# Altium project IR emitter.PrjPcb
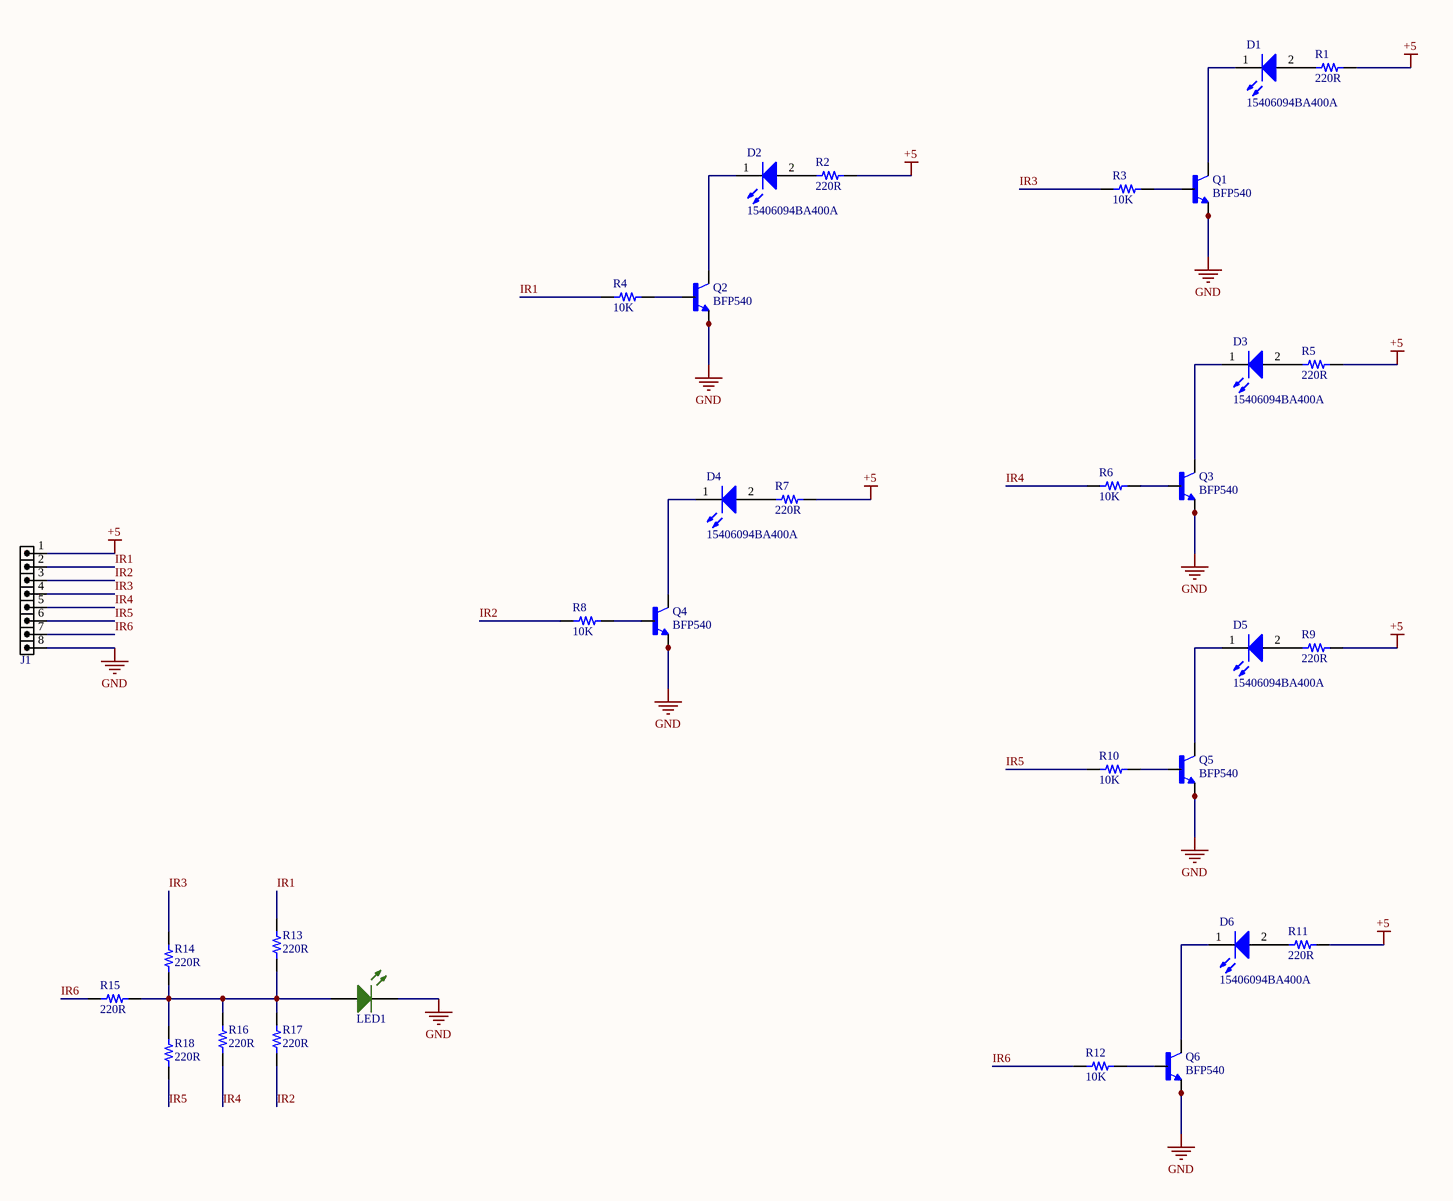
[diagram p0: IR emitter.SchDoc]
2 sheets, 64 parts. Net scope: global (net labels, ports and power ports of the same name join across sheets).
Board file: IR emitter.PcbDoc
Sheets:
  IR emitter.SchDoc
  Sheet1.SchDoc

## Sheet IR emitter.SchDoc
size A3; SheetNumber: 1; SheetTotal: 1

### Parts
D1  15406094BA400A  [WL-SICW_0603_L1.6W0.8H0.88]
D2  15406094BA400A  [WL-SICW_0603_L1.6W0.8H0.88]
D3  15406094BA400A  [WL-SICW_0603_L1.6W0.8H0.88]
D4  15406094BA400A  [WL-SICW_0603_L1.6W0.8H0.88]
D5  15406094BA400A  [WL-SICW_0603_L1.6W0.8H0.88]
D6  15406094BA400A  [WL-SICW_0603_L1.6W0.8H0.88]
J1  HDR1X8  [HDRR_M_1X8]  (value not drawn)
LED1  LED SMD 0603 GREEN  [LED_0603_GREEN]  (value not drawn)
Q1  BFP540  [TRANS_BFP540]
Q2  BFP540  [TRANS_BFP540]
Q3  BFP540  [TRANS_BFP540]
Q4  BFP540  [TRANS_BFP540]
Q5  BFP540  [TRANS_BFP540]
Q6  BFP540  [TRANS_BFP540]
R1  220R  [RES 0603_1608]
R2  220R  [RES 0603_1608]
R3  10K  [RES 0603_1608]
R4  10K  [RES 0603_1608]
R5  220R  [RES 0603_1608]
R6  10K  [RES 0603_1608]
R7  220R  [RES 0603_1608]
R8  10K  [RES 0603_1608]
R9  220R  [RES 0603_1608]
R10  10K  [RES 0603_1608]
R11  220R  [RES 0603_1608]
R12  10K  [RES 0603_1608]
R13  220R  [RES 0603_1608]
R14  220R  [RES 0603_1608]
R15  220R  [RES 0603_1608]
R16  220R  [RES 0603_1608]
R17  220R  [RES 0603_1608]
R18  220R  [RES 0603_1608]

### Nets
+5: J1.1 R1.1 R2.1 R5.1 R7.1 R9.1 R11.1
GND: J1.8 LED1.2(K) Q1.2(E) Q1.4(E) Q2.2(E) Q2.4(E) Q3.2(E) Q3.4(E) Q4.2(E) Q4.4(E) Q5.2(E) Q5.4(E) Q6.2(E) Q6.4(E)
IR1: J1.2 J1.7 R4.2 R12.2 R13.1 R15.2  [also labelled IR6]
IR2: J1.3 R8.2 R17.2
IR3: J1.4 R3.2 R14.1
IR4: J1.5 R6.2 R16.2
IR5: J1.6 R10.2 R18.2
NetD1_1: D1.1(K) Q1.3(C)
NetD1_2: D1.2(A) R1.2
NetD2_1: D2.1(K) Q2.3(C)
NetD2_2: D2.2(A) R2.2
NetD3_1: D3.1(K) Q3.3(C)
NetD3_2: D3.2(A) R5.2
NetD4_1: D4.1(K) Q4.3(C)
NetD4_2: D4.2(A) R7.2
NetD5_1: D5.1(K) Q5.3(C)
NetD5_2: D5.2(A) R9.2
NetD6_1: D6.1(K) Q6.3(C)
NetD6_2: D6.2(A) R11.2
NetLED1_1: LED1.1(A) R13.2 R14.2 R15.1 R16.1 R17.1 R18.1
NetQ1_1: Q1.1(B) R3.1
NetQ2_1: Q2.1(B) R4.1
NetQ3_1: Q3.1(B) R6.1
NetQ4_1: Q4.1(B) R8.1
NetQ5_1: Q5.1(B) R10.1
NetQ6_1: Q6.1(B) R12.1

### Library data of the parts
D1-D6 = CMP-03913-108242140-1: 15406094BA400A Ir Emitter, 940Nm, 0603 Rohs Compliant: Yes; Max Reverse Voltage (DC): 5V; Forward Current: 700mA; Forward Voltage: 1.2V; Viewing Angle: 140°; RoHS: Compliant; Peak Wavelength: 940nm; Width: 800µm; Min Operating Temperature: -40°C; NexarPartId: 108242140; Length: 1.6mm; Max Operating Temperature: 85°C; Height: 900µm
J1 = HDRR_M_1X8: CONN, HEADER, RightAngle, Male, pitch: 2.54mm, 8POS; VALUE: HDRM8
Q1-Q6 = BFP540: RF Transistor NPN 5V 80mA 30GHz 250mW Surface Mount PG-SOT343-4; MF: Infineon; Package: SOT-343 Infineon; Price: None; Check_prices: https://www.snapeda.com/parts/BFP540/Infineon/view-part/?ref=eda; Value: *; SnapEDA_Link: https://www.snapeda.com/parts/BFP540/Infineon/view-part/?ref=snap; MP: BFP540; Availability: In Stock; Purchase-URL: https://pricing.snapeda.com/search/part/BFP540/?ref=eda
R1-R18 = Res 0603: SMT Resistor; VALUE: 1K

## Sheet Sheet1.SchDoc
size A3; SheetNumber: 2; SheetTotal: 2
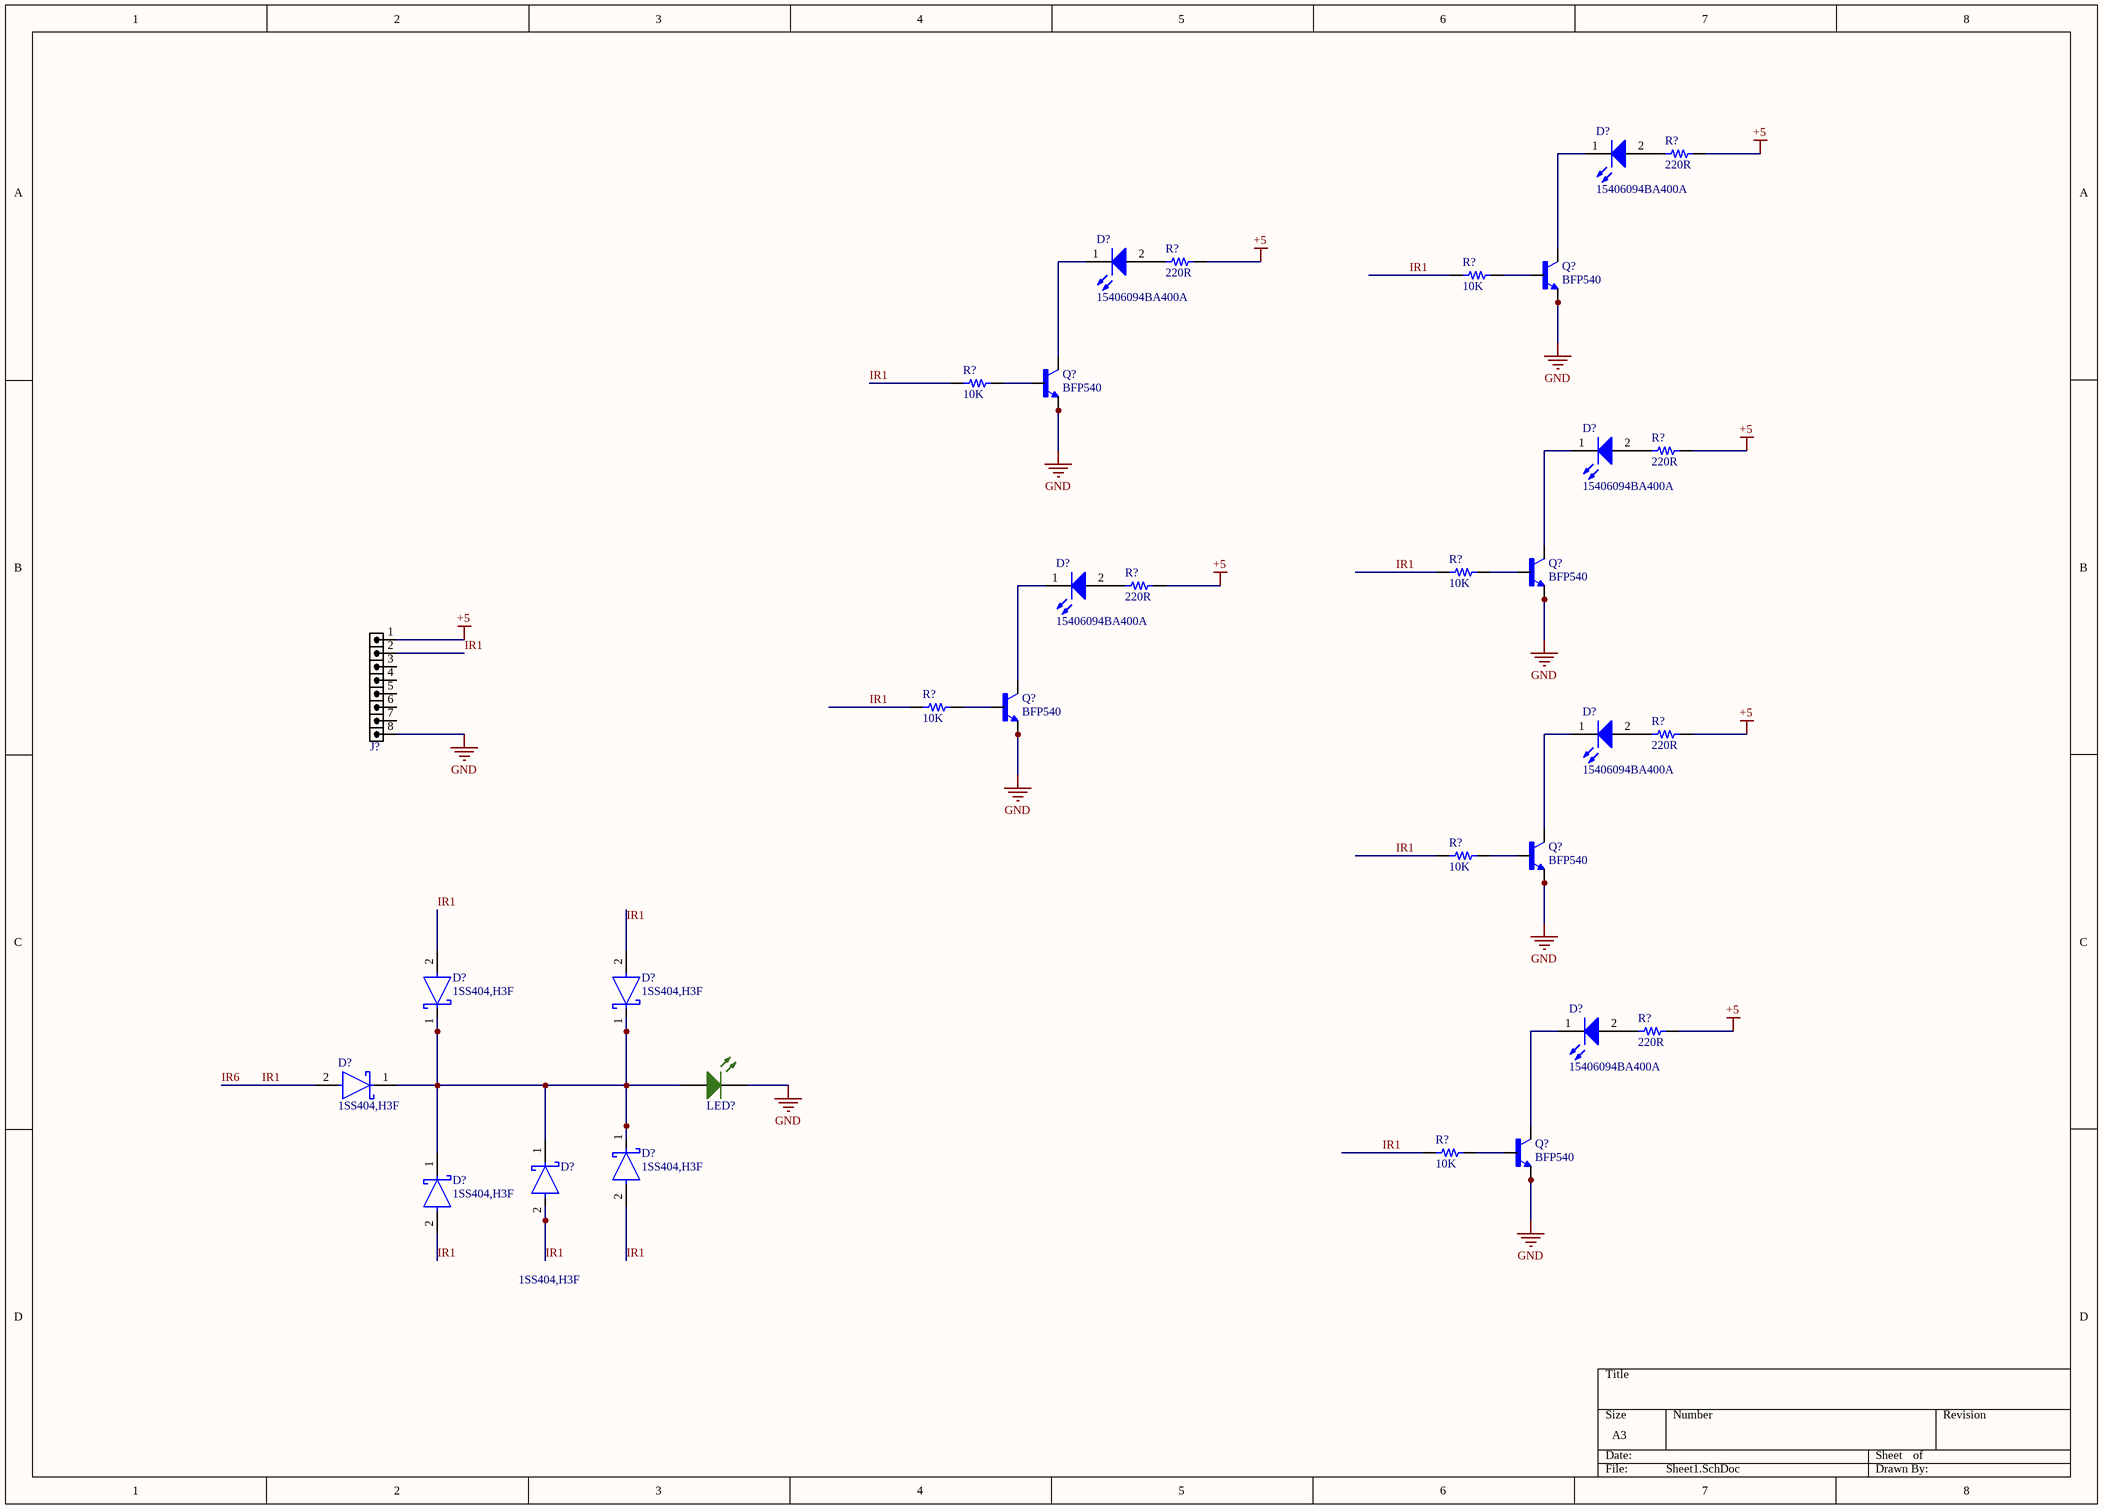
[diagram p1: Sheet1.SchDoc]

### Parts
(Parts that share a designator on the sheet are numbered #1, #2 ... from top to bottom, then left to right.)
D?#1  15406094BA400A  [WL-SICW_0603_L1.6W0.8H0.88]
D?#2  15406094BA400A  [WL-SICW_0603_L1.6W0.8H0.88]
D?#3  15406094BA400A  [WL-SICW_0603_L1.6W0.8H0.88]
D?#4  15406094BA400A  [WL-SICW_0603_L1.6W0.8H0.88]
D?#5  15406094BA400A  [WL-SICW_0603_L1.6W0.8H0.88]
D?#6  1SS404,H3F  [FP-SOD-323-MFG]
D?#7  1SS404,H3F  [FP-SOD-323-MFG]
D?#8  15406094BA400A  [WL-SICW_0603_L1.6W0.8H0.88]
D?#9  1SS404,H3F  [FP-SOD-323-MFG]
D?#10  1SS404,H3F  [FP-SOD-323-MFG]
D?#11  1SS404,H3F  [FP-SOD-323-MFG]
D?#12  1SS404,H3F  [FP-SOD-323-MFG]
J?  HDR1X8  [HDRR_M_1X8]  (value not drawn)
LED?  LED SMD 0603 GREEN  [LED_0603_GREEN]  (value not drawn)
Q?#1  BFP540  [TRANS_BFP540]
Q?#2  BFP540  [TRANS_BFP540]
Q?#3  BFP540  [TRANS_BFP540]
Q?#4  BFP540  [TRANS_BFP540]
Q?#5  BFP540  [TRANS_BFP540]
Q?#6  BFP540  [TRANS_BFP540]
R?#1  220R  [RES 0603_1608]
R?#2  220R  [RES 0603_1608]
R?#3  10K  [RES 0603_1608]
R?#4  10K  [RES 0603_1608]
R?#5  220R  [RES 0603_1608]
R?#6  10K  [RES 0603_1608]
R?#7  220R  [RES 0603_1608]
R?#8  10K  [RES 0603_1608]
R?#9  220R  [RES 0603_1608]
R?#10  10K  [RES 0603_1608]
R?#11  220R  [RES 0603_1608]
R?#12  10K  [RES 0603_1608]

### Nets
+5: J?.1 R?#1.1 R?#2.1 R?#5.1 R?#7.1 R?#9.1 R?#11.1
GND: J?.8 LED?.2(K) Q?#1.2(E) Q?#1.4(E) Q?#2.2(E) Q?#2.4(E) Q?#3.2(E) Q?#3.4(E) Q?#4.2(E) Q?#4.4(E) Q?#5.2(E) Q?#5.4(E) Q?#6.2(E) Q?#6.4(E)
IR1: D?#6.2(A) D?#7.2(A) D?#9.2(A) D?#10.2(A) D?#11.2(A) D?#12.2(A) J?.2 R?#3.2 R?#4.2 R?#6.2 R?#8.2 R?#10.2 R?#12.2  [also labelled IR6]
NetD?#1_1: D?#1.1(K) Q?#1.3(C)
NetD?#1_2: D?#1.2(A) R?#1.2
NetD?#2_1: D?#2.1(K) Q?#2.3(C)
NetD?#2_2: D?#2.2(A) R?#2.2
NetD?#3_1: D?#3.1(K) Q?#3.3(C)
NetD?#3_2: D?#3.2(A) R?#5.2
NetD?#4_1: D?#4.1(K) Q?#4.3(C)
NetD?#4_2: D?#4.2(A) R?#7.2
NetD?#5_1: D?#5.1(K) Q?#5.3(C)
NetD?#5_2: D?#5.2(A) R?#9.2
NetD?#6_1: D?#6.1(C) D?#7.1(C) D?#9.1(C) D?#10.1(C) D?#11.1(C) D?#12.1(C) LED?.1(A)
NetD?#8_1: D?#8.1(K) Q?#6.3(C)
NetD?#8_2: D?#8.2(A) R?#11.2
NetQ?#1_1: Q?#1.1(B) R?#3.1
NetQ?#2_1: Q?#2.1(B) R?#4.1
NetQ?#3_1: Q?#3.1(B) R?#6.1
NetQ?#4_1: Q?#4.1(B) R?#8.1
NetQ?#5_1: Q?#5.1(B) R?#10.1
NetQ?#6_1: Q?#6.1(B) R?#12.1

Not connected (* = marked no-connect by the designer): J? 3 4 5 6 7

### Library data of the parts
D?#1-D?#5 D?#8 = CMP-03913-108242140-1: as D1 on sheet IR emitter; RoHS: Compliant; Peak Wavelength: 940nm; Width: 800µm; Min Operating Temperature: -40°C; NexarPartId: 108242140; Length: 1.6mm; Max Operating Temperature: 85°C; Height: 900µm
D?#6 D?#7 D?#9-D?#12 = CMP-35905-000002-1: DIODE SCHOTTKY 20V 300MA USC; Max Repetitive Reverse Voltage (Vrrm): 25V; Element Configuration: Single; Mount: Surface Mount; Max Reverse Voltage (DC): 20V; Forward Current: 300mA; Packaging: Tape and Reel; Case/Package: SOD; Max Operating Temperature: 100°C; Min Operating Temperature: -40°C; Contact Plating: Tin; Average Rectified Current: 300mA
J? = HDRR_M_1X8: as J1 on sheet IR emitter
Q?#1-Q?#6 = BFP540: as Q1 on sheet IR emitter; Package: SOT-343 Infineon; Price: None; Check_prices: https://www.snapeda.com/parts/BFP540/Infineon/view-part/?ref=eda; Value: *; SnapEDA_Link: https://www.snapeda.com/parts/BFP540/Infineon/view-part/?ref=snap; MP: BFP540; Availability: In Stock; Purchase-URL: https://pricing.snapeda.com/search/part/BFP540/?ref=eda
R?#1-R?#12 = Res 0603: SMT Resistor; VALUE: 1K

## Nets that join several sheets
+5: IR emitter (7 pins), Sheet1 (7 pins)
GND: IR emitter (14 pins), Sheet1 (14 pins)
IR1: IR emitter (6 pins), Sheet1 (13 pins)